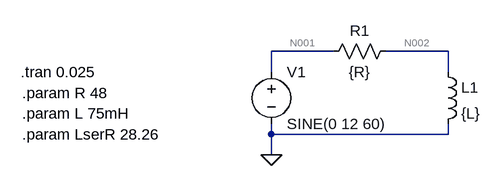
[diagram p0: schematic RL_circuit.asc]
RL_circuit.asc, the LTspice schematic file:
Version 4
SHEET 1 880 680
WIRE 144 64 48 64
WIRE 320 64 224 64
WIRE 48 96 48 64
WIRE 320 96 320 64
WIRE 48 192 48 176
WIRE 320 192 320 176
WIRE 320 192 48 192
WIRE 48 224 48 192
FLAG 48 224 0
SYMBOL voltage 48 80 R0
WINDOW 123 0 0 Left 2
WINDOW 39 0 0 Left 2
SYMATTR InstName V1
SYMATTR Value SINE(0 12 60)
SYMBOL ind 304 80 R0
SYMATTR InstName L1
SYMATTR Value {L}
SYMATTR SpiceLine Rser={LserR}
SYMBOL res 240 48 R90
WINDOW 0 0 56 VBottom 2
WINDOW 3 32 56 VTop 2
SYMATTR InstName R1
SYMATTR Value {R}
TEXT -338 96 Left 2 !.tran 0.025
TEXT -336 160 Left 2 !.param L 75mH
TEXT -336 128 Left 2 !.param R 48
TEXT -336 192 Left 2 !.param LserR 28.26

The netlist it stands for:
* RL_circuit.asc
V1 N001 0 SINE(0 12 60)
L1 N002 0 {L} Rser={LserR}
R1 N002 N001 {R}
.tran 0.025
.param L 75mH
.param R 48
.param LserR 28.26
.backanno
.end

* Results of the author's LTspice run, read from the files saved beside the schematic
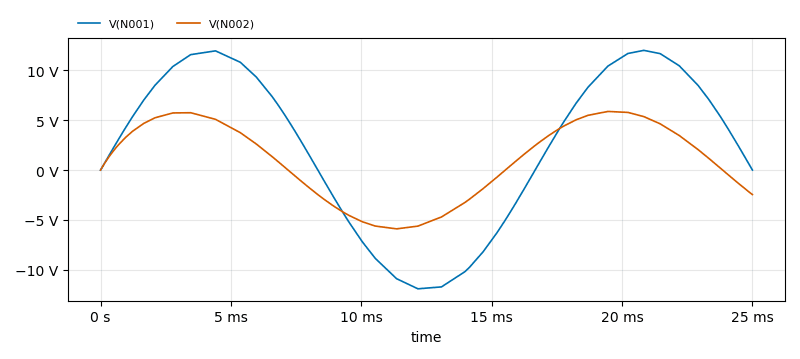
[diagram p1: Transient Analysis of RL_circuit.asc, plotted from the saved traces]
* Transient Analysis, 1 run:
*   V(N001): min -11.91 V, max 12 V, average 2.535 V, rms 8.45 V, last 0 V
*   V(N002): min -5.898 V, max 5.875 V, average 1.034 V, rms 4.08 V, last -2.462 V